# EAGLE schematic SSPS Front Panel (EAGLE 7.4.0)
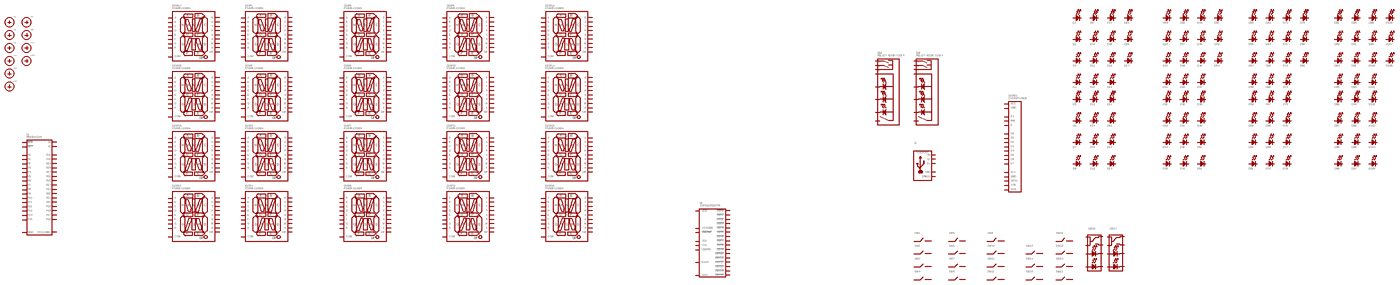
[diagram p0: schematic, sheet 1, overview]
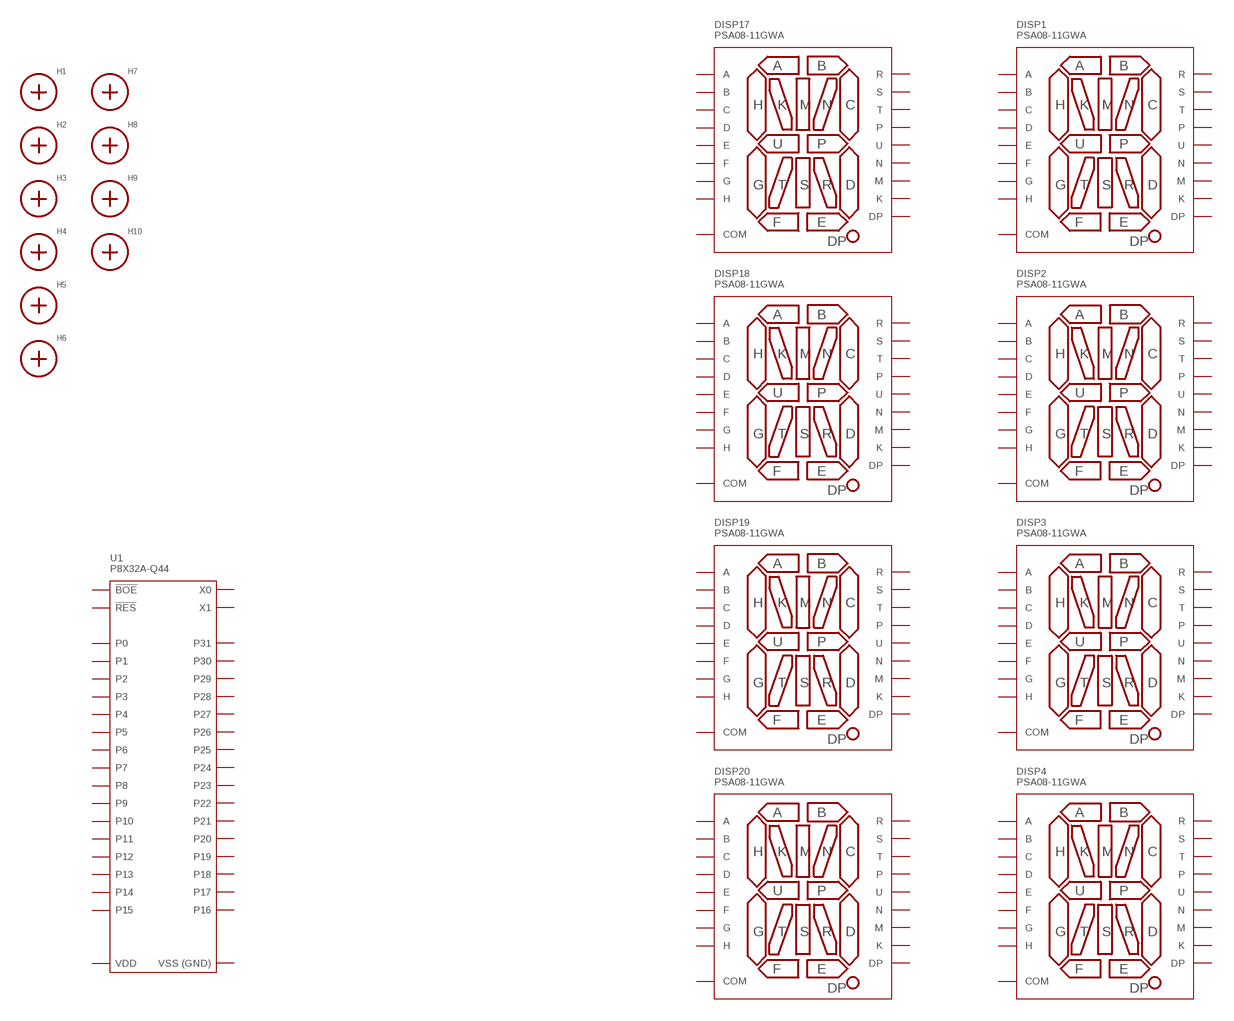
[diagram p1: schematic, sheet 1, part 1 of 4]
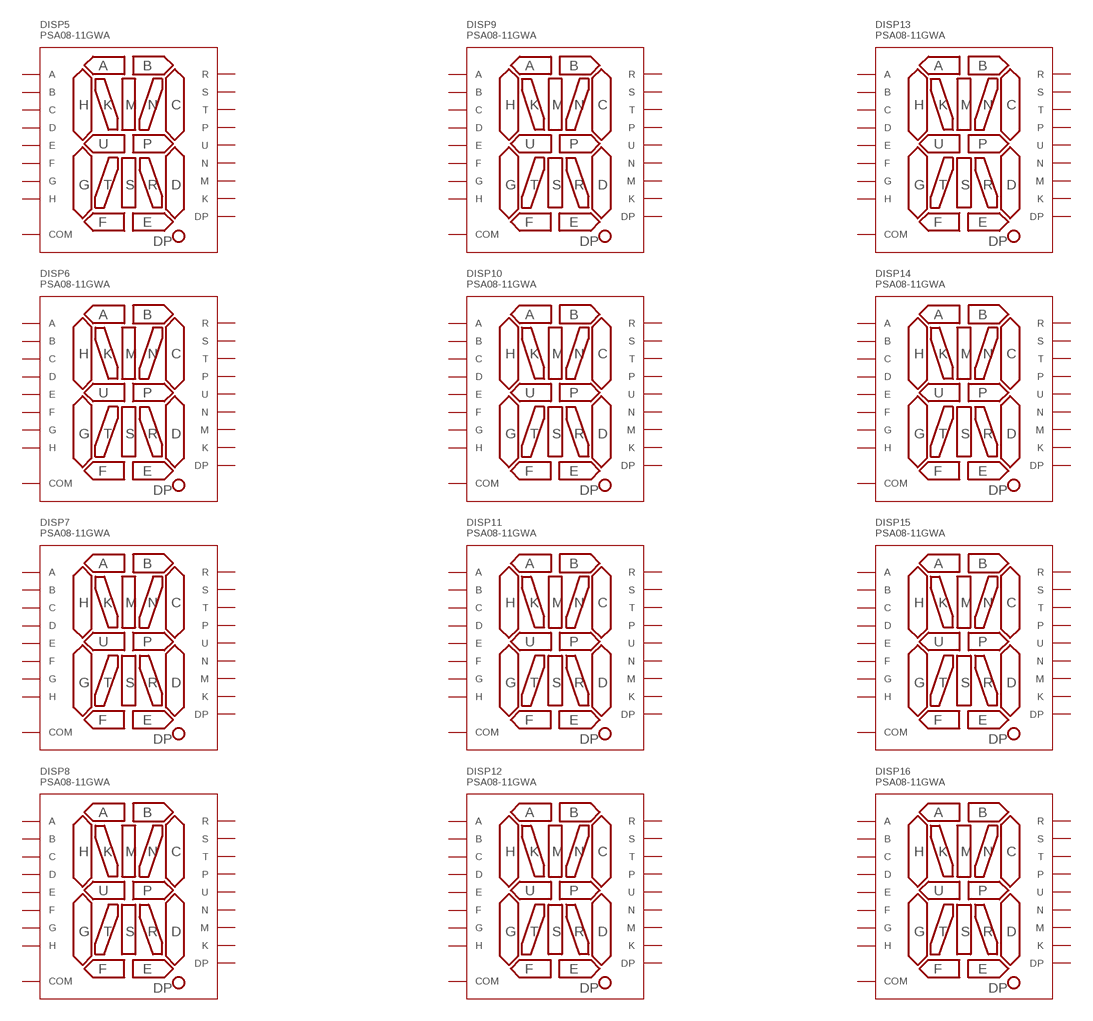
[diagram p2: schematic, sheet 1, part 2 of 4]
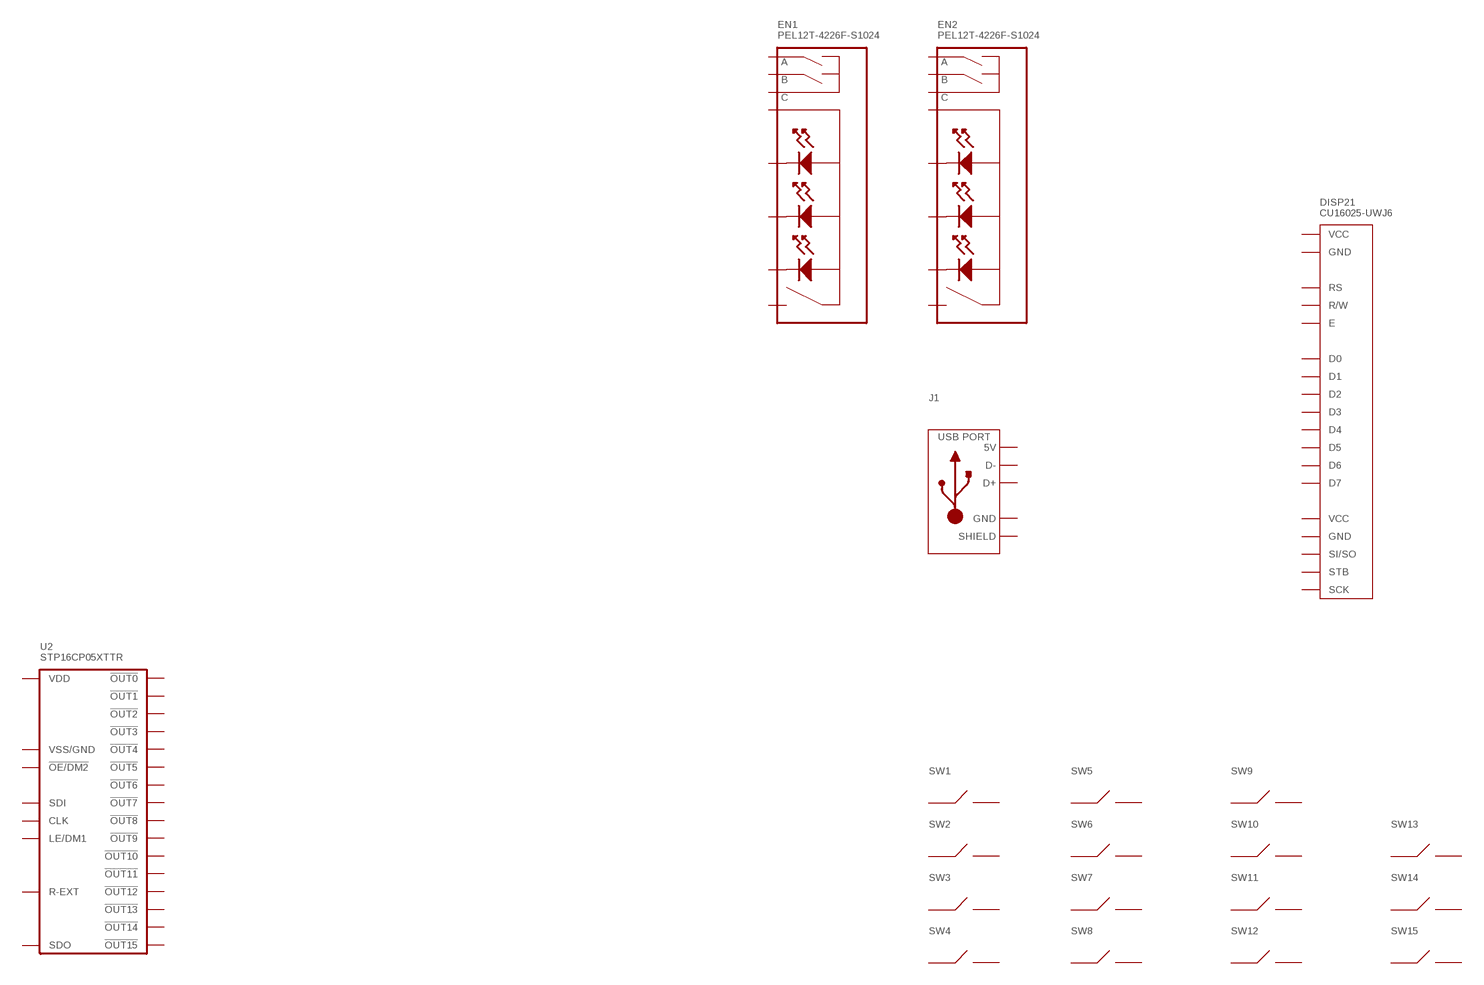
[diagram p3: schematic, sheet 1, part 3 of 4]
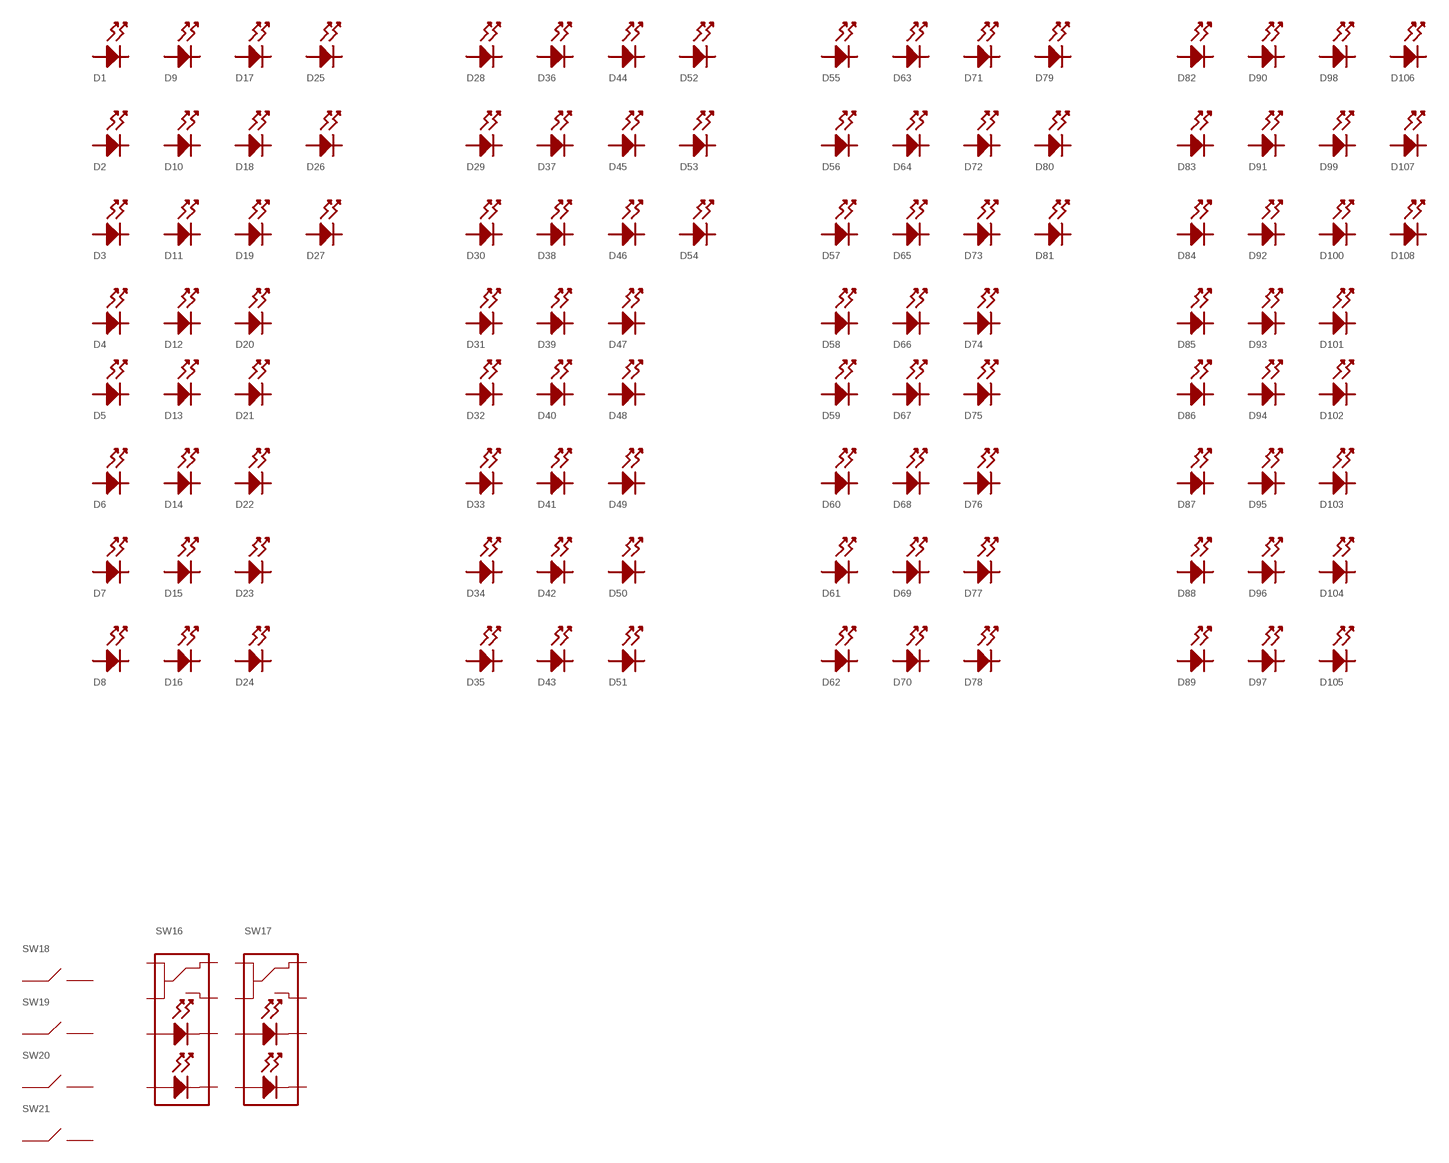
[diagram p4: schematic, sheet 1, part 4 of 4]

## Parts
D1  LED_SINGLE_WP1043  [WP1043]
D2  LED_SINGLE_WP1043  [WP1043]
D3  LED_SINGLE_WP1043  [WP1043]
D4  LED_SINGLE_WP1043  [WP1043]
D5  LED_SINGLE_WP1043  [WP1043]
D6  LED_SINGLE_WP1043  [WP1043]
D7  LED_SINGLE_WP1043  [WP1043]
D8  LED_SINGLE_WP1043  [WP1043]
D9  LED_SINGLE_WP1043  [WP1043]
D10  LED_SINGLE_WP1043  [WP1043]
D11  LED_SINGLE_WP1043  [WP1043]
D12  LED_SINGLE_WP1043  [WP1043]
D13  LED_SINGLE_WP1043  [WP1043]
D14  LED_SINGLE_WP1043  [WP1043]
D15  LED_SINGLE_WP1043  [WP1043]
D16  LED_SINGLE_WP1043  [WP1043]
D17  LED_SINGLE_WP1043  [WP1043]
D18  LED_SINGLE_WP1043  [WP1043]
D19  LED_SINGLE_WP1043  [WP1043]
D20  LED_SINGLE_WP1043  [WP1043]
D21  LED_SINGLE_WP1043  [WP1043]
D22  LED_SINGLE_WP1043  [WP1043]
D23  LED_SINGLE_WP1043  [WP1043]
D24  LED_SINGLE_WP1043  [WP1043]
D25  LED_SINGLE_WP1043  [WP1043]
D26  LED_SINGLE_WP1043  [WP1043]
D27  LED_SINGLE_WP1043  [WP1043]
D28  LED_SINGLE_WP1043  [WP1043]
D29  LED_SINGLE_WP1043  [WP1043]
D30  LED_SINGLE_WP1043  [WP1043]
D31  LED_SINGLE_WP1043  [WP1043]
D32  LED_SINGLE_WP1043  [WP1043]
D33  LED_SINGLE_WP1043  [WP1043]
D34  LED_SINGLE_WP1043  [WP1043]
D35  LED_SINGLE_WP1043  [WP1043]
D36  LED_SINGLE_WP1043  [WP1043]
D37  LED_SINGLE_WP1043  [WP1043]
D38  LED_SINGLE_WP1043  [WP1043]
D39  LED_SINGLE_WP1043  [WP1043]
D40  LED_SINGLE_WP1043  [WP1043]
D41  LED_SINGLE_WP1043  [WP1043]
D42  LED_SINGLE_WP1043  [WP1043]
D43  LED_SINGLE_WP1043  [WP1043]
D44  LED_SINGLE_WP1043  [WP1043]
D45  LED_SINGLE_WP1043  [WP1043]
D46  LED_SINGLE_WP1043  [WP1043]
D47  LED_SINGLE_WP1043  [WP1043]
D48  LED_SINGLE_WP1043  [WP1043]
D49  LED_SINGLE_WP1043  [WP1043]
D50  LED_SINGLE_WP1043  [WP1043]
D51  LED_SINGLE_WP1043  [WP1043]
D52  LED_SINGLE_WP1043  [WP1043]
D53  LED_SINGLE_WP1043  [WP1043]
D54  LED_SINGLE_WP1043  [WP1043]
D55  LED_SINGLE_WP1043  [WP1043]
D56  LED_SINGLE_WP1043  [WP1043]
D57  LED_SINGLE_WP1043  [WP1043]
D58  LED_SINGLE_WP1043  [WP1043]
D59  LED_SINGLE_WP1043  [WP1043]
D60  LED_SINGLE_WP1043  [WP1043]
D61  LED_SINGLE_WP1043  [WP1043]
D62  LED_SINGLE_WP1043  [WP1043]
D63  LED_SINGLE_WP1043  [WP1043]
D64  LED_SINGLE_WP1043  [WP1043]
D65  LED_SINGLE_WP1043  [WP1043]
D66  LED_SINGLE_WP1043  [WP1043]
D67  LED_SINGLE_WP1043  [WP1043]
D68  LED_SINGLE_WP1043  [WP1043]
D69  LED_SINGLE_WP1043  [WP1043]
D70  LED_SINGLE_WP1043  [WP1043]
D71  LED_SINGLE_WP1043  [WP1043]
D72  LED_SINGLE_WP1043  [WP1043]
D73  LED_SINGLE_WP1043  [WP1043]
D74  LED_SINGLE_WP1043  [WP1043]
D75  LED_SINGLE_WP1043  [WP1043]
D76  LED_SINGLE_WP1043  [WP1043]
D77  LED_SINGLE_WP1043  [WP1043]
D78  LED_SINGLE_WP1043  [WP1043]
D79  LED_SINGLE_WP1043  [WP1043]
D80  LED_SINGLE_WP1043  [WP1043]
D81  LED_SINGLE_WP1043  [WP1043]
D82  LED_SINGLE_WP1043  [WP1043]
D83  LED_SINGLE_WP1043  [WP1043]
D84  LED_SINGLE_WP1043  [WP1043]
D85  LED_SINGLE_WP1043  [WP1043]
D86  LED_SINGLE_WP1043  [WP1043]
D87  LED_SINGLE_WP1043  [WP1043]
D88  LED_SINGLE_WP1043  [WP1043]
D89  LED_SINGLE_WP1043  [WP1043]
D90  LED_SINGLE_WP1043  [WP1043]
D91  LED_SINGLE_WP1043  [WP1043]
D92  LED_SINGLE_WP1043  [WP1043]
D93  LED_SINGLE_WP1043  [WP1043]
D94  LED_SINGLE_WP1043  [WP1043]
D95  LED_SINGLE_WP1043  [WP1043]
D96  LED_SINGLE_WP1043  [WP1043]
D97  LED_SINGLE_WP1043  [WP1043]
D98  LED_SINGLE_WP1043  [WP1043]
D99  LED_SINGLE_WP1043  [WP1043]
D100  LED_SINGLE_WP1043  [WP1043]
D101  LED_SINGLE_WP1043  [WP1043]
D102  LED_SINGLE_WP1043  [WP1043]
D103  LED_SINGLE_WP1043  [WP1043]
D104  LED_SINGLE_WP1043  [WP1043]
D105  LED_SINGLE_WP1043  [WP1043]
D106  LED_SINGLE_WP1043  [WP1043]
D107  LED_SINGLE_WP1043  [WP1043]
D108  LED_SINGLE_WP1043  [WP1043]
DISP1  PSA08-11GWA  PSA08-11SRWA  [PSA08-11SRWA]
DISP2  PSA08-11GWA  PSA08-11SRWA  [PSA08-11SRWA]
DISP3  PSA08-11GWA  PSA08-11SRWA  [PSA08-11SRWA]
DISP4  PSA08-11GWA  PSA08-11SRWA  [PSA08-11SRWA]
DISP5  PSA08-11GWA  PSA08-11SRWA  [PSA08-11SRWA]
DISP6  PSA08-11GWA  PSA08-11SRWA  [PSA08-11SRWA]
DISP7  PSA08-11GWA  PSA08-11SRWA  [PSA08-11SRWA]
DISP8  PSA08-11GWA  PSA08-11SRWA  [PSA08-11SRWA]
DISP9  PSA08-11GWA  PSA08-11SRWA  [PSA08-11SRWA]
DISP10  PSA08-11GWA  PSA08-11SRWA  [PSA08-11SRWA]
DISP11  PSA08-11GWA  PSA08-11SRWA  [PSA08-11SRWA]
DISP12  PSA08-11GWA  PSA08-11SRWA  [PSA08-11SRWA]
DISP13  PSA08-11GWA  PSA08-11SRWA  [PSA08-11SRWA]
DISP14  PSA08-11GWA  PSA08-11SRWA  [PSA08-11SRWA]
DISP15  PSA08-11GWA  PSA08-11SRWA  [PSA08-11SRWA]
DISP16  PSA08-11GWA  PSA08-11SRWA  [PSA08-11SRWA]
DISP17  PSA08-11GWA  PSA08-11SRWA  [PSA08-11SRWA]
DISP18  PSA08-11GWA  PSA08-11SRWA  [PSA08-11SRWA]
DISP19  PSA08-11GWA  PSA08-11SRWA  [PSA08-11SRWA]
DISP20  PSA08-11GWA  PSA08-11SRWA  [PSA08-11SRWA]
DISP21  CU16025-UWJ6  [CU16025-UW6J]
EN1  PEL12T-4226F-S1024  PEL12T  [PEL12T]
EN2  PEL12T-4226F-S1024  PEL12T  [PEL12T]
H1  MOUNT_HOLE150MIL  [MOUNT_HOLE_150MIL]
H2  MOUNT_HOLE150MIL  [MOUNT_HOLE_150MIL]
H3  MOUNT_HOLE150MIL  [MOUNT_HOLE_150MIL]
H4  MOUNT_HOLE150MIL  [MOUNT_HOLE_150MIL]
H5  MOUNT_HOLE150MIL  [MOUNT_HOLE_150MIL]
H6  MOUNT_HOLE150MIL  [MOUNT_HOLE_150MIL]
H7  MOUNT_HOLE150MIL  [MOUNT_HOLE_150MIL]
H8  MOUNT_HOLE150MIL  [MOUNT_HOLE_150MIL]
H9  MOUNT_HOLE150MIL  [MOUNT_HOLE_150MIL]
H10  MOUNT_HOLE150MIL  [MOUNT_HOLE_150MIL]
J1  USB_4PIN_61400413321  [61400413321]
SW1  SPST_MX1A  [MX1A]
SW2  SPST_MX1A  [MX1A]
SW3  SPST_MX1A  [MX1A]
SW4  SPST_MX1A  [MX1A]
SW5  SPST_MX1A  [MX1A]
SW6  SPST_MX1A  [MX1A]
SW7  SPST_MX1A  [MX1A]
SW8  SPST_MX1A  [MX1A]
SW9  SPST_MX1A  [MX1A]
SW10  SPST_MX1A  [MX1A]
SW11  SPST_MX1A  [MX1A]
SW12  SPST_MX1A  [MX1A]
SW13  SPST_MX1A  [MX1A]
SW14  SPST_MX1A  [MX1A]
SW15  SPST_MX1A  [MX1A]
SW16  5501  [5501]
SW17  5501  [5501]
SW18  SPST_MX1A  [MX1A]
SW19  SPST_MX1A  [MX1A]
SW20  SPST_MX1A  [MX1A]
SW21  SPST_MX1A  [MX1A]
U1  P8X32A-Q44  [LQFP44]
U2  STP16CP05XTTR  [STP16CP05XTTR_TTSOP-24]
Unconnected: D1.A(ANODE) D1.C(CATHODE) D2.A(ANODE) D2.C(CATHODE) D3.A(ANODE) D3.C(CATHODE) D4.A(ANODE) D4.C(CATHODE) D5.A(ANODE) D5.C(CATHODE) D6.A(ANODE) D6.C(CATHODE) D7.A(ANODE) D7.C(CATHODE) D8.A(ANODE) D8.C(CATHODE) D9.A(ANODE) D9.C(CATHODE) D10.A(ANODE) D10.C(CATHODE) D11.A(ANODE) D11.C(CATHODE) D12.A(ANODE) D12.C(CATHODE) D13.A(ANODE) D13.C(CATHODE) D14.A(ANODE) D14.C(CATHODE) D15.A(ANODE) D15.C(CATHODE) D16.A(ANODE) D16.C(CATHODE) D17.A(ANODE) D17.C(CATHODE) D18.A(ANODE) D18.C(CATHODE) D19.A(ANODE) D19.C(CATHODE) D20.A(ANODE) D20.C(CATHODE) D21.A(ANODE) D21.C(CATHODE) D22.A(ANODE) D22.C(CATHODE) D23.A(ANODE) D23.C(CATHODE) D24.A(ANODE) D24.C(CATHODE) D25.A(ANODE) D25.C(CATHODE) D26.A(ANODE) D26.C(CATHODE) D27.A(ANODE) D27.C(CATHODE) D28.A(ANODE) D28.C(CATHODE) D29.A(ANODE) D29.C(CATHODE) D30.A(ANODE) D30.C(CATHODE) D31.A(ANODE) D31.C(CATHODE) D32.A(ANODE) D32.C(CATHODE) D33.A(ANODE) D33.C(CATHODE) D34.A(ANODE) D34.C(CATHODE) D35.A(ANODE) D35.C(CATHODE) D36.A(ANODE) D36.C(CATHODE) D37.A(ANODE) D37.C(CATHODE) D38.A(ANODE) D38.C(CATHODE) D39.A(ANODE) D39.C(CATHODE) D40.A(ANODE) D40.C(CATHODE) D41.A(ANODE) D41.C(CATHODE) D42.A(ANODE) D42.C(CATHODE) D43.A(ANODE) D43.C(CATHODE) D44.A(ANODE) D44.C(CATHODE) D45.A(ANODE) D45.C(CATHODE) D46.A(ANODE) D46.C(CATHODE) D47.A(ANODE) D47.C(CATHODE) D48.A(ANODE) D48.C(CATHODE) D49.A(ANODE) D49.C(CATHODE) D50.A(ANODE) D50.C(CATHODE) D51.A(ANODE) D51.C(CATHODE) D52.A(ANODE) D52.C(CATHODE) D53.A(ANODE) D53.C(CATHODE) D54.A(ANODE) D54.C(CATHODE) D55.A(ANODE) D55.C(CATHODE) D56.A(ANODE) D56.C(CATHODE) D57.A(ANODE) D57.C(CATHODE) D58.A(ANODE) D58.C(CATHODE) D59.A(ANODE) D59.C(CATHODE) D60.A(ANODE) D60.C(CATHODE) D61.A(ANODE) D61.C(CATHODE) D62.A(ANODE) D62.C(CATHODE) D63.A(ANODE) D63.C(CATHODE) D64.A(ANODE) D64.C(CATHODE) D65.A(ANODE) D65.C(CATHODE) D66.A(ANODE) D66.C(CATHODE) D67.A(ANODE) D67.C(CATHODE) D68.A(ANODE) D68.C(CATHODE) D69.A(ANODE) D69.C(CATHODE) D70.A(ANODE) D70.C(CATHODE) D71.A(ANODE) D71.C(CATHODE) D72.A(ANODE) D72.C(CATHODE) D73.A(ANODE) D73.C(CATHODE) D74.A(ANODE) D74.C(CATHODE) D75.A(ANODE) D75.C(CATHODE) D76.A(ANODE) D76.C(CATHODE) D77.A(ANODE) D77.C(CATHODE) D78.A(ANODE) D78.C(CATHODE) D79.A(ANODE) D79.C(CATHODE) D80.A(ANODE) D80.C(CATHODE) D81.A(ANODE) D81.C(CATHODE) D82.A(ANODE) D82.C(CATHODE) D83.A(ANODE) D83.C(CATHODE) D84.A(ANODE) D84.C(CATHODE) D85.A(ANODE) D85.C(CATHODE) D86.A(ANODE) D86.C(CATHODE) D87.A(ANODE) D87.C(CATHODE) D88.A(ANODE) D88.C(CATHODE) D89.A(ANODE) D89.C(CATHODE) D90.A(ANODE) D90.C(CATHODE) D91.A(ANODE) D91.C(CATHODE) D92.A(ANODE) D92.C(CATHODE) D93.A(ANODE) D93.C(CATHODE) D94.A(ANODE) D94.C(CATHODE) D95.A(ANODE) D95.C(CATHODE) D96.A(ANODE) D96.C(CATHODE) D97.A(ANODE) D97.C(CATHODE) D98.A(ANODE) D98.C(CATHODE) D99.A(ANODE) D99.C(CATHODE) D100.A(ANODE) D100.C(CATHODE) D101.A(ANODE) D101.C(CATHODE) D102.A(ANODE) D102.C(CATHODE) D103.A(ANODE) D103.C(CATHODE) D104.A(ANODE) D104.C(CATHODE) D105.A(ANODE) D105.C(CATHODE) D106.A(ANODE) D106.C(CATHODE) D107.A(ANODE) D107.C(CATHODE) D108.A(ANODE) D108.C(CATHODE) DISP1.P$1(A) DISP1.P$2(M) DISP1.P$3(K) DISP1.P$4(H) DISP1.P$5(U) DISP1.P$6(S) DISP1.P$7(T) DISP1.P$8(G) DISP1.P$9(F) DISP1.P$10(E) DISP1.P$11(COM) DISP1.P$12(DP) DISP1.P$13(D) DISP1.P$14(R) DISP1.P$15(P) DISP1.P$16(C) DISP1.P$17(N) DISP1.P$18(B) DISP2.P$1(A) DISP2.P$2(M) DISP2.P$3(K) DISP2.P$4(H) DISP2.P$5(U) DISP2.P$6(S) DISP2.P$7(T) DISP2.P$8(G) DISP2.P$9(F) DISP2.P$10(E) DISP2.P$11(COM) DISP2.P$12(DP) DISP2.P$13(D) DISP2.P$14(R) DISP2.P$15(P) DISP2.P$16(C) DISP2.P$17(N) DISP2.P$18(B) DISP3.P$1(A) DISP3.P$2(M) DISP3.P$3(K) DISP3.P$4(H) DISP3.P$5(U) DISP3.P$6(S) DISP3.P$7(T) DISP3.P$8(G) DISP3.P$9(F) DISP3.P$10(E) DISP3.P$11(COM) DISP3.P$12(DP) DISP3.P$13(D) DISP3.P$14(R) DISP3.P$15(P) DISP3.P$16(C) DISP3.P$17(N) DISP3.P$18(B) DISP4.P$1(A) DISP4.P$2(M) DISP4.P$3(K) DISP4.P$4(H) DISP4.P$5(U) DISP4.P$6(S) DISP4.P$7(T) DISP4.P$8(G) DISP4.P$9(F) DISP4.P$10(E) DISP4.P$11(COM) DISP4.P$12(DP) DISP4.P$13(D) DISP4.P$14(R) DISP4.P$15(P) DISP4.P$16(C) DISP4.P$17(N) DISP4.P$18(B) DISP5.P$1(A) DISP5.P$2(M) DISP5.P$3(K) DISP5.P$4(H) DISP5.P$5(U) DISP5.P$6(S) DISP5.P$7(T) DISP5.P$8(G) DISP5.P$9(F) DISP5.P$10(E) DISP5.P$11(COM) DISP5.P$12(DP) DISP5.P$13(D) DISP5.P$14(R) DISP5.P$15(P) DISP5.P$16(C) DISP5.P$17(N) DISP5.P$18(B) DISP6.P$1(A) DISP6.P$2(M) DISP6.P$3(K) DISP6.P$4(H) DISP6.P$5(U) DISP6.P$6(S) DISP6.P$7(T) DISP6.P$8(G) DISP6.P$9(F) DISP6.P$10(E) DISP6.P$11(COM) DISP6.P$12(DP) DISP6.P$13(D) DISP6.P$14(R) DISP6.P$15(P) DISP6.P$16(C) DISP6.P$17(N) DISP6.P$18(B) DISP7.P$1(A) DISP7.P$2(M) DISP7.P$3(K) DISP7.P$4(H) DISP7.P$5(U) DISP7.P$6(S) DISP7.P$7(T) DISP7.P$8(G) DISP7.P$9(F) DISP7.P$10(E) DISP7.P$11(COM) DISP7.P$12(DP) DISP7.P$13(D) DISP7.P$14(R) DISP7.P$15(P) DISP7.P$16(C) DISP7.P$17(N) DISP7.P$18(B) DISP8.P$1(A) DISP8.P$2(M) DISP8.P$3(K) DISP8.P$4(H) DISP8.P$5(U) DISP8.P$6(S) DISP8.P$7(T) DISP8.P$8(G) DISP8.P$9(F) DISP8.P$10(E) DISP8.P$11(COM) DISP8.P$12(DP) DISP8.P$13(D) DISP8.P$14(R) DISP8.P$15(P) DISP8.P$16(C) DISP8.P$17(N) DISP8.P$18(B) DISP9.P$1(A) DISP9.P$2(M) DISP9.P$3(K) DISP9.P$4(H) DISP9.P$5(U) DISP9.P$6(S) DISP9.P$7(T) DISP9.P$8(G) DISP9.P$9(F) DISP9.P$10(E) DISP9.P$11(COM) DISP9.P$12(DP) DISP9.P$13(D) DISP9.P$14(R) DISP9.P$15(P) DISP9.P$16(C) DISP9.P$17(N) DISP9.P$18(B) DISP10.P$1(A) DISP10.P$2(M) DISP10.P$3(K) DISP10.P$4(H) DISP10.P$5(U) DISP10.P$6(S) DISP10.P$7(T) DISP10.P$8(G) DISP10.P$9(F) DISP10.P$10(E) DISP10.P$11(COM) DISP10.P$12(DP) DISP10.P$13(D) DISP10.P$14(R) DISP10.P$15(P) DISP10.P$16(C) DISP10.P$17(N) DISP10.P$18(B) DISP11.P$1(A) DISP11.P$2(M) DISP11.P$3(K) DISP11.P$4(H) DISP11.P$5(U) DISP11.P$6(S) DISP11.P$7(T) DISP11.P$8(G) DISP11.P$9(F) DISP11.P$10(E) DISP11.P$11(COM) DISP11.P$12(DP) DISP11.P$13(D) DISP11.P$14(R) DISP11.P$15(P) DISP11.P$16(C) DISP11.P$17(N) DISP11.P$18(B) DISP12.P$1(A) DISP12.P$2(M) DISP12.P$3(K) DISP12.P$4(H) DISP12.P$5(U) DISP12.P$6(S) DISP12.P$7(T) DISP12.P$8(G) DISP12.P$9(F) DISP12.P$10(E) DISP12.P$11(COM) DISP12.P$12(DP) DISP12.P$13(D) DISP12.P$14(R) DISP12.P$15(P) DISP12.P$16(C) DISP12.P$17(N) DISP12.P$18(B) DISP13.P$1(A) DISP13.P$2(M) DISP13.P$3(K) DISP13.P$4(H) DISP13.P$5(U) DISP13.P$6(S) DISP13.P$7(T) DISP13.P$8(G) DISP13.P$9(F) DISP13.P$10(E) DISP13.P$11(COM) DISP13.P$12(DP) DISP13.P$13(D) DISP13.P$14(R) DISP13.P$15(P) DISP13.P$16(C) DISP13.P$17(N) DISP13.P$18(B) DISP14.P$1(A) DISP14.P$2(M) DISP14.P$3(K) DISP14.P$4(H) DISP14.P$5(U) DISP14.P$6(S) DISP14.P$7(T) DISP14.P$8(G) DISP14.P$9(F) DISP14.P$10(E) DISP14.P$11(COM) DISP14.P$12(DP) DISP14.P$13(D) DISP14.P$14(R) DISP14.P$15(P) DISP14.P$16(C) DISP14.P$17(N) DISP14.P$18(B) DISP15.P$1(A) DISP15.P$2(M) DISP15.P$3(K) DISP15.P$4(H) DISP15.P$5(U) DISP15.P$6(S) DISP15.P$7(T) DISP15.P$8(G) DISP15.P$9(F) DISP15.P$10(E) DISP15.P$11(COM) DISP15.P$12(DP) DISP15.P$13(D) DISP15.P$14(R) DISP15.P$15(P) DISP15.P$16(C) DISP15.P$17(N) DISP15.P$18(B) DISP16.P$1(A) DISP16.P$2(M) DISP16.P$3(K) DISP16.P$4(H) DISP16.P$5(U) DISP16.P$6(S) DISP16.P$7(T) DISP16.P$8(G) DISP16.P$9(F) DISP16.P$10(E) DISP16.P$11(COM) DISP16.P$12(DP) DISP16.P$13(D) DISP16.P$14(R) DISP16.P$15(P) DISP16.P$16(C) DISP16.P$17(N) DISP16.P$18(B) DISP17.P$1(A) DISP17.P$2(M) DISP17.P$3(K) DISP17.P$4(H) DISP17.P$5(U) DISP17.P$6(S) DISP17.P$7(T) DISP17.P$8(G) DISP17.P$9(F) DISP17.P$10(E) DISP17.P$11(COM) DISP17.P$12(DP) DISP17.P$13(D) DISP17.P$14(R) DISP17.P$15(P) DISP17.P$16(C) DISP17.P$17(N) DISP17.P$18(B) DISP18.P$1(A) DISP18.P$2(M) DISP18.P$3(K) DISP18.P$4(H) DISP18.P$5(U) DISP18.P$6(S) DISP18.P$7(T) DISP18.P$8(G) DISP18.P$9(F) DISP18.P$10(E) DISP18.P$11(COM) DISP18.P$12(DP) DISP18.P$13(D) DISP18.P$14(R) DISP18.P$15(P) DISP18.P$16(C) DISP18.P$17(N) DISP18.P$18(B) DISP19.P$1(A) DISP19.P$2(M) DISP19.P$3(K) DISP19.P$4(H) DISP19.P$5(U) DISP19.P$6(S) DISP19.P$7(T) DISP19.P$8(G) DISP19.P$9(F) DISP19.P$10(E) DISP19.P$11(COM) DISP19.P$12(DP) DISP19.P$13(D) DISP19.P$14(R) DISP19.P$15(P) DISP19.P$16(C) DISP19.P$17(N) DISP19.P$18(B) DISP20.P$1(A) DISP20.P$2(M) DISP20.P$3(K) DISP20.P$4(H) DISP20.P$5(U) DISP20.P$6(S) DISP20.P$7(T) DISP20.P$8(G) DISP20.P$9(F) DISP20.P$10(E) DISP20.P$11(COM) DISP20.P$12(DP) DISP20.P$13(D) DISP20.P$14(R) DISP20.P$15(P) DISP20.P$16(C) DISP20.P$17(N) DISP20.P$18(B) DISP21.P$1(GND1) DISP21.P$2(VCC1) DISP21.P$4(RS) DISP21.P$5(R/W) DISP21.P$6(E) DISP21.P$7(D0) DISP21.P$8(D1) DISP21.P$9(D2) DISP21.P$10(D3) DISP21.P$11(D4) DISP21.P$12(D5) DISP21.P$13(D6) DISP21.P$14(D7) DISP21.P$16(SCK) DISP21.P$17(STB) DISP21.P$18(GND2) DISP21.P$19(SI/SO) DISP21.P$20(VCC2) EN1.1 EN1.2 EN1.3 EN1.4 EN1.5 EN1.A EN1.B EN1.C EN2.1 EN2.2 EN2.3 EN2.4 EN2.5 EN2.A EN2.B EN2.C J1.1(5V) J1.2(D-) J1.3(D+) J1.4(GND) SW1.P$1(A) SW1.P$2(B) SW2.P$1(A) SW2.P$2(B) SW3.P$1(A) SW3.P$2(B) SW4.P$1(A) SW4.P$2(B) SW5.P$1(A) SW5.P$2(B) SW6.P$1(A) SW6.P$2(B) SW7.P$1(A) SW7.P$2(B) SW8.P$1(A) SW8.P$2(B) SW9.P$1(A) SW9.P$2(B) SW10.P$1(A) SW10.P$2(B) SW11.P$1(A) SW11.P$2(B) SW12.P$1(A) SW12.P$2(B) SW13.P$1(A) SW13.P$2(B) SW14.P$1(A) SW14.P$2(B) SW15.P$1(A) SW15.P$2(B) SW16.1A SW16.1B SW16.2 SW16.3 SW16.ANODE_1 SW16.ANODE_2 SW16.CATHODE_1 SW16.CATHODE_2 SW17.1A SW17.1B SW17.2 SW17.3 SW17.ANODE_1 SW17.ANODE_2 SW17.CATHODE_1 SW17.CATHODE_2 SW18.P$1(A) SW18.P$2(B) SW19.P$1(A) SW19.P$2(B) SW20.P$1(A) SW20.P$2(B) SW21.P$1(A) SW21.P$2(B) U1.1(P4) U1.2(P5) U1.3(P6) U1.4(P7) U1.6(BOE') U1.7(RES') U1.9(P8) U1.10(P9) U1.11(P10) U1.12(P11) U1.13(P12) U1.14(P13) U1.15(P14) U1.16(P15) U1.19(P16) U1.20(P17) U1.21(P18) U1.22(P19) U1.23(P20) U1.24(P21) U1.25(P22) U1.26(P23) U1.28(X1) U1.29(X0) U1.31(P24) U1.32(P25) U1.33(P26) U1.34(P27) U1.35(P28) U1.36(P29) U1.37(P30) U1.38(P31) U1.41(P0) U1.42(P1) U1.43(P2) U1.44(P3) U2.P$1(VSS/GND) U2.P$2(SDI) U2.P$3(CLK) U2.P$4(LE/DM1) U2.P$5(!OUT0) U2.P$6(!OUT1) U2.P$7(!OUT2) U2.P$8(!OUT3) U2.P$9(!OUT4) U2.P$10(!OUT5) U2.P$11(!OUT6) U2.P$12(!OUT7) U2.P$13(!OUT8) U2.P$14(!OUT9) U2.P$15(!OUT10) U2.P$16(!OUT11) U2.P$17(!OUT12) U2.P$18(!OUT13) U2.P$19(!OUT14) U2.P$20(!OUT15) U2.P$21(!OE/DM2) U2.P$22(SDO) U2.P$23(R-EXT) U2.P$24(VDD) U2.PAD(VSS/GND)

## Power pins joined to a net without a drawn wire
SLD: J1.S1(SLD) J1.S2(SLD)
VDD: U1.8(VDD) U1.18(VDD) U1.30(VDD) U1.40(VDD)
VSS: U1.5(VSS) U1.17(VSS) U1.27(VSS) U1.39(VSS)

## Library data of the parts
D1-D108 = PP_LED:LED_SINGLE
DISP1-DISP20 = PP_LED:PSA08-11SRWA
DISP21 = PP_Displays:CU16025-UWJ6
EN1 EN2 = PP_Electromechanical:PEL12T
H1-H10 = PP_Connectors:MOUNT_HOLE; POPULATE: 1
J1 = PP_Connectors:USB_4PIN; POPULATE: 1
SW1-SW15 SW18-SW21 = PP_Electromechanical:SPST: SPST Switches
SW16 SW17 = PP_Electromechanical:5501
U1 = MF_IC_Digital:P8X32A: Manufacturer Part #: P8X32A Manufacturer: Parallax Description: 32-bit Microcontrollers - MCU LQFP pkg Propeller Chip; HOUSEPART: NO; MPN: P8X32A-Q44; POPULATE: 1; URL: https://www.parallax.com/sites/default/files/downloads/P8X32A-Propeller-Datasheet-v1.4.0_0.pdf
U2 = PP_DigitalIC:STP16CP05